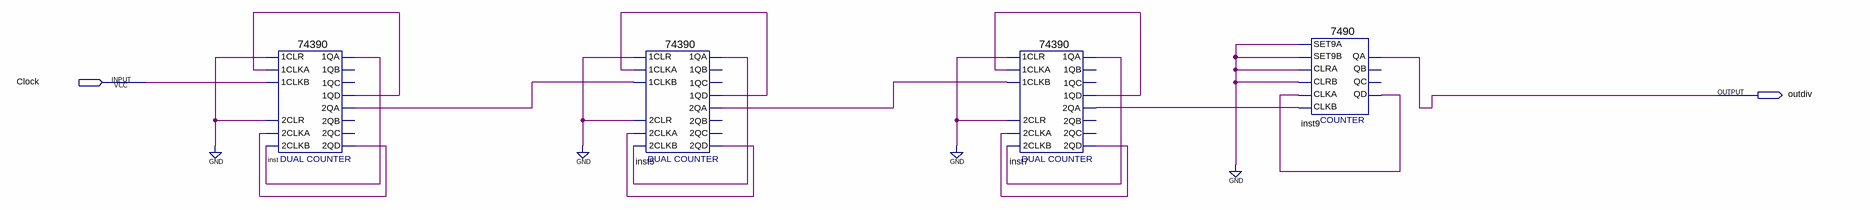
[diagram p0: schematic sheet]
// Quartus schematic DIV5HZ2.bdf as structural Verilog: 4 symbols, 2 pins
module DIV5HZ2 (
  input  Clock,
  output outdiv
);

  wire inst5_1qa, inst5_1qd, inst5_2qa, inst5_2qd, inst7_1qa, inst7_1qd, inst7_2qa, inst7_2qd, inst9_qd,
       inst_1qa, inst_1qd, inst_2qa, inst_2qd;

  \74390  inst (
    .\2CLKA (inst_2qd), .\2CLR (1'b0), .\2CLKB (inst_1qa), .\1CLR (1'b0), .\1CLKA (inst_1qd),
    .\1CLKB (Clock), .\1QA (inst_1qa), .\1QD (inst_1qd), .\2QA (inst_2qa), .\2QD (inst_2qd));  // open: 1QB, 1QC, 2QB, 2QC
  \74390  inst5 (
    .\2CLKA (inst5_2qd), .\2CLR (1'b0), .\2CLKB (inst5_1qa), .\1CLR (1'b0), .\1CLKA (inst5_1qd),
    .\1CLKB (inst_2qa), .\1QA (inst5_1qa), .\1QD (inst5_1qd), .\2QA (inst5_2qa), .\2QD (inst5_2qd));  // open: 1QB, 1QC, 2QB, 2QC
  \74390  inst7 (
    .\2CLKA (inst7_2qd), .\2CLR (1'b0), .\2CLKB (inst7_1qa), .\1CLR (1'b0), .\1CLKA (inst7_1qd),
    .\1CLKB (inst5_2qa), .\1QA (inst7_1qa), .\1QD (inst7_1qd), .\2QA (inst7_2qa), .\2QD (inst7_2qd));  // open: 1QB, 1QC, 2QB, 2QC
  \7490  inst9 (
    .SET9A(1'b0), .CLRA(1'b0), .SET9B(1'b0), .CLKB(inst7_2qa), .CLKA(inst9_qd), .CLRB(1'b0), .QD(inst9_qd),
    .QA(outdiv));  // open: QB, QC
endmodule
